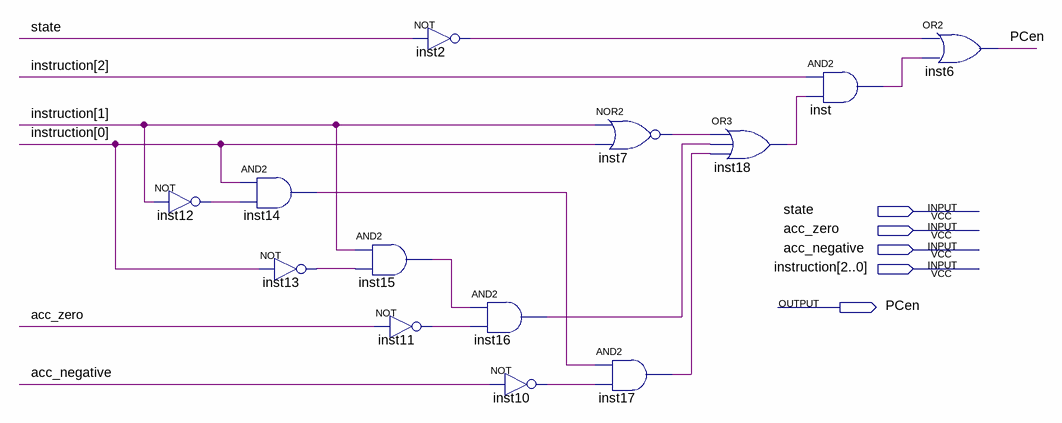
[diagram p0: schematic sheet]
// Quartus schematic controler_pc_enable.bdf as structural Verilog: 13 symbols, 5 pins
module controler_pc_enable (
  input  state,
  input  acc_zero,
  input  acc_negative,
  input  [2:0] instruction,
  output PCen
);

  wire inst2_out, inst7_out, inst10_out, inst11_out, inst12_out, inst13_out, inst14_out, inst15_out,
       inst16_out, inst17_out, inst18_out, inst_out;

  not inst12 (inst12_out, instruction[1]);
  and inst14 (inst14_out, instruction[0], inst12_out);
  not inst13 (inst13_out, instruction[0]);
  and inst15 (inst15_out, instruction[1], inst13_out);
  not inst11 (inst11_out, acc_zero);
  not inst2 (inst2_out, state);
  and inst16 (inst16_out, inst15_out, inst11_out);
  not inst10 (inst10_out, acc_negative);
  nor inst7 (inst7_out, instruction[1], instruction[0]);
  and inst17 (inst17_out, inst14_out, inst10_out);
  or inst18 (inst18_out, inst7_out, inst16_out, inst17_out);
  and inst (inst_out, instruction[2], inst18_out);
  or inst6 (PCen, inst2_out, inst_out);
endmodule
